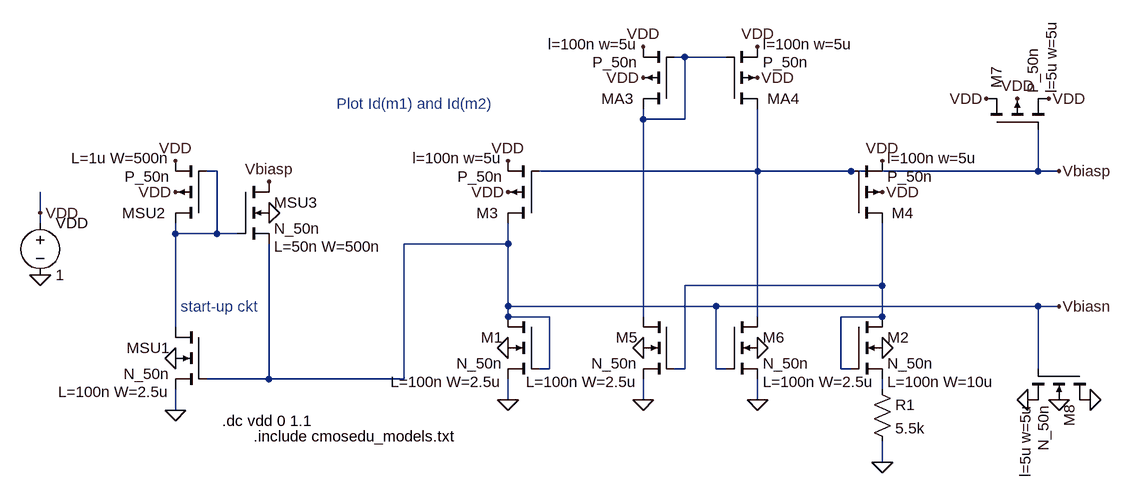
[diagram p0: schematic Fig20_23.asc]
Fig20_23.asc, the LTspice schematic file:
Version 4
SHEET 1 1988 680
WIRE 1280 -336 1264 -336
WIRE 1344 -336 1280 -336
WIRE 1216 -240 1216 -256
WIRE 1280 -240 1280 -336
WIRE 1280 -240 1216 -240
WIRE 560 -160 544 -160
WIRE 1392 -160 1392 -256
WIRE 1392 -160 1056 -160
WIRE 1536 -160 1392 -160
WIRE 1824 -160 1824 -224
WIRE 1824 -160 1536 -160
WIRE 1856 -160 1824 -160
WIRE 288 -96 288 -128
WIRE 288 -80 288 -96
WIRE 496 -64 496 -80
WIRE 560 -64 560 -160
WIRE 560 -64 496 -64
WIRE 592 -64 560 -64
WIRE 1008 -48 1008 -80
WIRE 1008 -48 848 -48
WIRE 1584 16 1584 -80
WIRE 1584 16 1280 16
WIRE 1008 48 1008 -48
WIRE 1328 48 1008 48
WIRE 1824 48 1328 48
WIRE 1856 48 1824 48
WIRE 1008 64 1008 48
WIRE 1072 64 1008 64
WIRE 1216 64 1216 -240
WIRE 1392 64 1392 -160
WIRE 1584 64 1584 16
WIRE 1584 64 1520 64
WIRE 496 80 496 -64
WIRE 1072 144 1072 64
WIRE 1072 144 1056 144
WIRE 1280 144 1280 16
WIRE 1280 144 1264 144
WIRE 1328 144 1328 48
WIRE 1344 144 1328 144
WIRE 1520 144 1520 64
WIRE 1536 144 1520 144
WIRE 1824 144 1824 48
WIRE 640 160 640 -48
WIRE 640 160 544 160
WIRE 848 160 848 -48
WIRE 848 160 640 160
WIRE 1584 176 1584 160
WIRE 1008 192 1008 160
WIRE 1216 192 1216 160
WIRE 1392 192 1392 160
WIRE 1824 192 1808 192
WIRE 496 208 496 176
WIRE 1584 288 1584 256
FLAG 288 0 0
FLAG 288 -96 VDD
FLAG 496 -128 VDD
FLAG 496 -176 VDD
FLAG 496 208 0
FLAG 496 128 0
FLAG 640 -96 0
FLAG 1008 -128 VDD
FLAG 1008 -176 VDD
FLAG 1584 -128 VDD
FLAG 1584 -176 VDD
FLAG 1856 -160 Vbiasp
FLAG 1008 192 0
FLAG 1008 112 0
FLAG 1584 288 0
FLAG 1584 112 0
FLAG 1856 48 Vbiasn
FLAG 1392 -304 VDD
FLAG 1392 -352 VDD
FLAG 1216 -304 VDD
FLAG 1216 -352 VDD
FLAG 1216 112 0
FLAG 1392 112 0
FLAG 1216 192 0
FLAG 1392 192 0
FLAG 1792 -272 VDD
FLAG 1744 -272 VDD
FLAG 1840 -272 VDD
FLAG 1856 192 0
FLAG 1808 192 0
FLAG 1904 192 0
FLAG 640 -144 Vbiasp
SYMBOL voltage 288 -96 R0
WINDOW 123 0 0 Left 2
WINDOW 39 0 0 Left 2
SYMATTR InstName VDD
SYMATTR Value 1
SYMBOL pmos4 544 -80 R180
WINDOW 0 63 16 Left 2
WINDOW 123 56 100 Left 2
SYMATTR InstName MSU2
SYMATTR Value2 L=1u W=500n
SYMATTR Value P_50n
SYMBOL nmos4 544 80 M0
WINDOW 123 56 100 Left 2
SYMATTR Value2 L=100n W=2.5u
SYMATTR InstName MSU1
SYMATTR Value N_50n
SYMBOL nmos4 592 -144 R0
WINDOW 123 56 100 Left 2
SYMATTR Value2 L=50n W=500n
SYMATTR InstName MSU3
SYMATTR Value N_50n
SYMBOL pmos4 1056 -80 R180
WINDOW 0 63 16 Left 2
WINDOW 123 56 100 Left 2
SYMATTR InstName M3
SYMATTR Value2 l=100n w=5u
SYMATTR Value P_50n
SYMBOL pmos4 1536 -80 M180
WINDOW 0 63 16 Left 2
WINDOW 123 56 100 Left 2
SYMATTR InstName M4
SYMATTR Value2 l=100n w=5u
SYMATTR Value P_50n
SYMBOL nmos4 1056 64 M0
WINDOW 123 56 100 Left 2
SYMATTR Value2 L=100n W=2.5u
SYMATTR InstName M1
SYMATTR Value N_50n
SYMBOL nmos4 1536 64 R0
WINDOW 123 56 100 Left 2
SYMATTR Value2 L=100n W=10u
SYMATTR InstName M2
SYMATTR Value N_50n
SYMBOL res 1568 160 R0
SYMATTR InstName R1
SYMATTR Value 5.5k
SYMBOL pmos4 1344 -256 M180
WINDOW 0 63 16 Left 2
WINDOW 123 56 100 Left 2
SYMATTR InstName MA4
SYMATTR Value2 l=100n w=5u
SYMATTR Value P_50n
SYMBOL pmos4 1264 -256 R180
WINDOW 0 63 16 Left 2
WINDOW 123 56 100 Left 2
SYMATTR InstName MA3
SYMATTR Value2 l=100n w=5u
SYMATTR Value P_50n
SYMBOL nmos4 1264 64 M0
WINDOW 123 56 100 Left 2
SYMATTR Value2 L=100n W=2.5u
SYMATTR InstName M5
SYMATTR Value N_50n
SYMBOL nmos4 1344 64 R0
WINDOW 123 56 100 Left 2
SYMATTR Value2 L=100n W=2.5u
SYMATTR InstName M6
SYMATTR Value N_50n
SYMBOL pmos4 1744 -224 R270
WINDOW 0 63 16 Left 2
WINDOW 123 56 100 Left 2
SYMATTR InstName M7
SYMATTR Value2 l=5u w=5u
SYMATTR Value P_50n
SYMBOL nmos4 1904 144 R90
WINDOW 123 56 100 Left 2
SYMATTR Value2 l=5u w=5u
SYMATTR InstName M8
SYMATTR Value N_50n
TEXT 616 248 Left 2 !.include cmosedu_models.txt
TEXT 568 224 Left 2 !.dc vdd 0 1.1
TEXT 504 48 Left 2 ;start-up ckt
TEXT 744 -264 Left 2 ;Plot Id(m1) and Id(m2)

The netlist it stands for:
* Fig20_23.asc
VDD VDD 0 1
MSU2 N002 N002 VDD VDD P_50n L=1u W=500n
MSU1 N002 Vbiasn 0 0 N_50n L=100n W=2.5u
MSU3 Vbiasp N002 Vbiasn 0 N_50n L=50n W=500n
M3 Vbiasn Vbiasp VDD VDD P_50n l=100n w=5u
M4 N003 Vbiasp VDD VDD P_50n l=100n w=5u
M1 Vbiasn Vbiasn 0 0 N_50n L=100n W=2.5u
M2 N003 N003 N004 0 N_50n L=100n W=10u
R1 N004 0 5.5k
MA4 Vbiasp N001 VDD VDD P_50n l=100n w=5u
MA3 N001 N001 VDD VDD P_50n l=100n w=5u
M5 N001 N003 0 0 N_50n L=100n W=2.5u
M6 Vbiasp Vbiasn 0 0 N_50n L=100n W=2.5u
M7 VDD Vbiasp VDD VDD P_50n l=5u w=5u
M8 0 Vbiasn 0 0 N_50n l=5u w=5u
.model NMOS NMOS
.model PMOS PMOS
.lib standard.mos
.include cmosedu_models.txt
.dc vdd 0 1.1
* start-up ckt
* Plot Id(m1) and Id(m2)
.backanno
.end